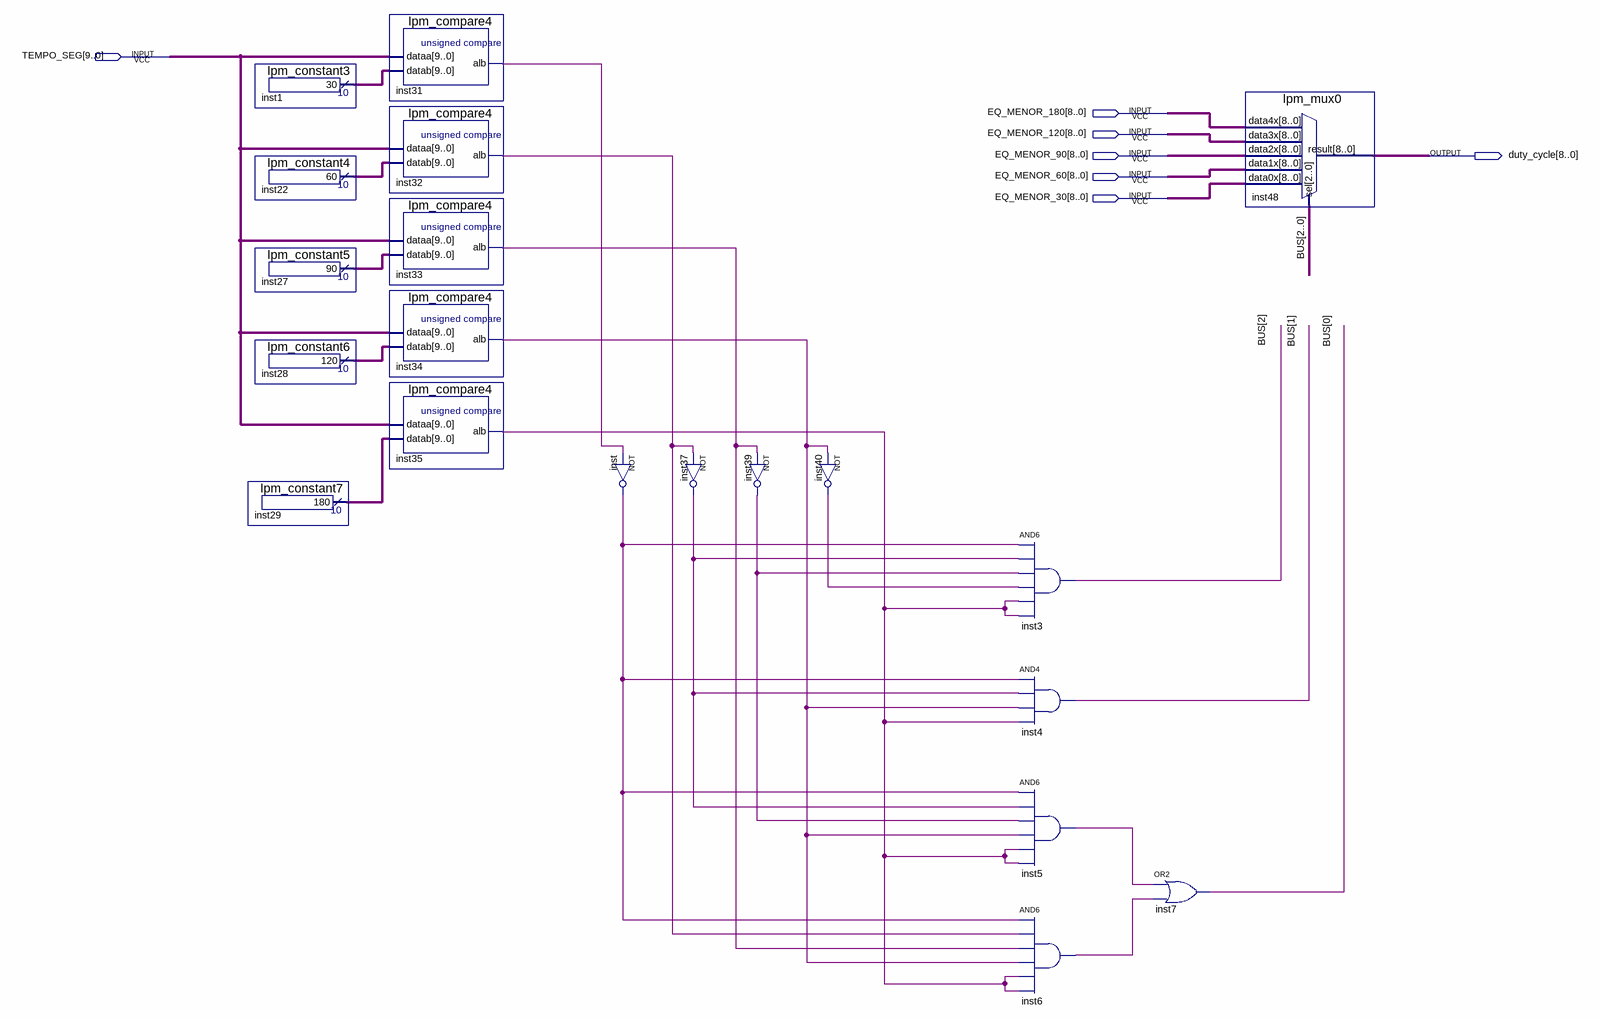
[diagram p0: schematic sheet]
// Quartus schematic seletor_cuva.bdf as structural Verilog: 20 symbols, 7 pins
module seletor_cuva (
  input  [9:0] TEMPO_SEG,
  input  [8:0] EQ_MENOR_180,
  input  [8:0] EQ_MENOR_120,
  input  [8:0] EQ_MENOR_90,
  input  [8:0] EQ_MENOR_60,
  input  [8:0] EQ_MENOR_30,
  output [8:0] duty_cycle
);

  wire inst5_out, inst6_out, inst31_alb, inst32_alb, inst33_alb, inst34_alb, inst35_alb, inst37_out,
       inst39_out, inst40_out, inst_out;
  wire [2:0] BUS;
  wire [9:0] inst1_result, inst22_result, inst27_result, inst28_result, inst29_result;

  lpm_constant3 inst1 (.result(inst1_result));
  lpm_constant4 inst22 (.result(inst22_result));
  lpm_constant5 inst27 (.result(inst27_result));
  lpm_constant6 inst28 (.result(inst28_result));
  lpm_constant7 inst29 (.result(inst29_result));
  lpm_compare4 inst31 (.dataa(TEMPO_SEG), .datab(inst1_result), .alb(inst31_alb));
  lpm_compare4 inst32 (.dataa(TEMPO_SEG), .datab(inst22_result), .alb(inst32_alb));
  lpm_compare4 inst33 (.dataa(TEMPO_SEG), .datab(inst27_result), .alb(inst33_alb));
  lpm_compare4 inst34 (.dataa(TEMPO_SEG), .datab(inst28_result), .alb(inst34_alb));
  lpm_compare4 inst35 (.dataa(TEMPO_SEG), .datab(inst29_result), .alb(inst35_alb));
  not inst (inst_out, inst31_alb);
  not inst37 (inst37_out, inst32_alb);
  not inst39 (inst39_out, inst33_alb);
  not inst40 (inst40_out, inst34_alb);
  and inst3 (BUS[2], inst_out, inst37_out, inst39_out, inst40_out, inst35_alb, inst35_alb);
  and inst4 (BUS[1], inst_out, inst37_out, inst34_alb, inst35_alb);
  and inst5 (inst5_out, inst_out, inst37_out, inst39_out, inst34_alb, inst35_alb, inst35_alb);
  and inst6 (inst6_out, inst_out, inst32_alb, inst33_alb, inst34_alb, inst35_alb, inst35_alb);
  or inst7 (BUS[0], inst5_out, inst6_out);
  lpm_mux0 inst48 (
    .data4x(EQ_MENOR_180), .data3x(EQ_MENOR_120), .data2x(EQ_MENOR_90), .data1x(EQ_MENOR_60),
    .data0x(EQ_MENOR_30), .sel(BUS), .result(duty_cycle));
endmodule
